# EasyEDA Pro project ProPrj_iamge v2_2026-08-18.epro, schematic Schematic1
Board Name: Board1; Create Date: 2026-07-20; Page Name: P1; Project Name: iamge v2; Schematic Name: Schematic1; Update Date: 2026-07-25; Company: EasyEDA.com; Page Size: A4; Version: V1.0
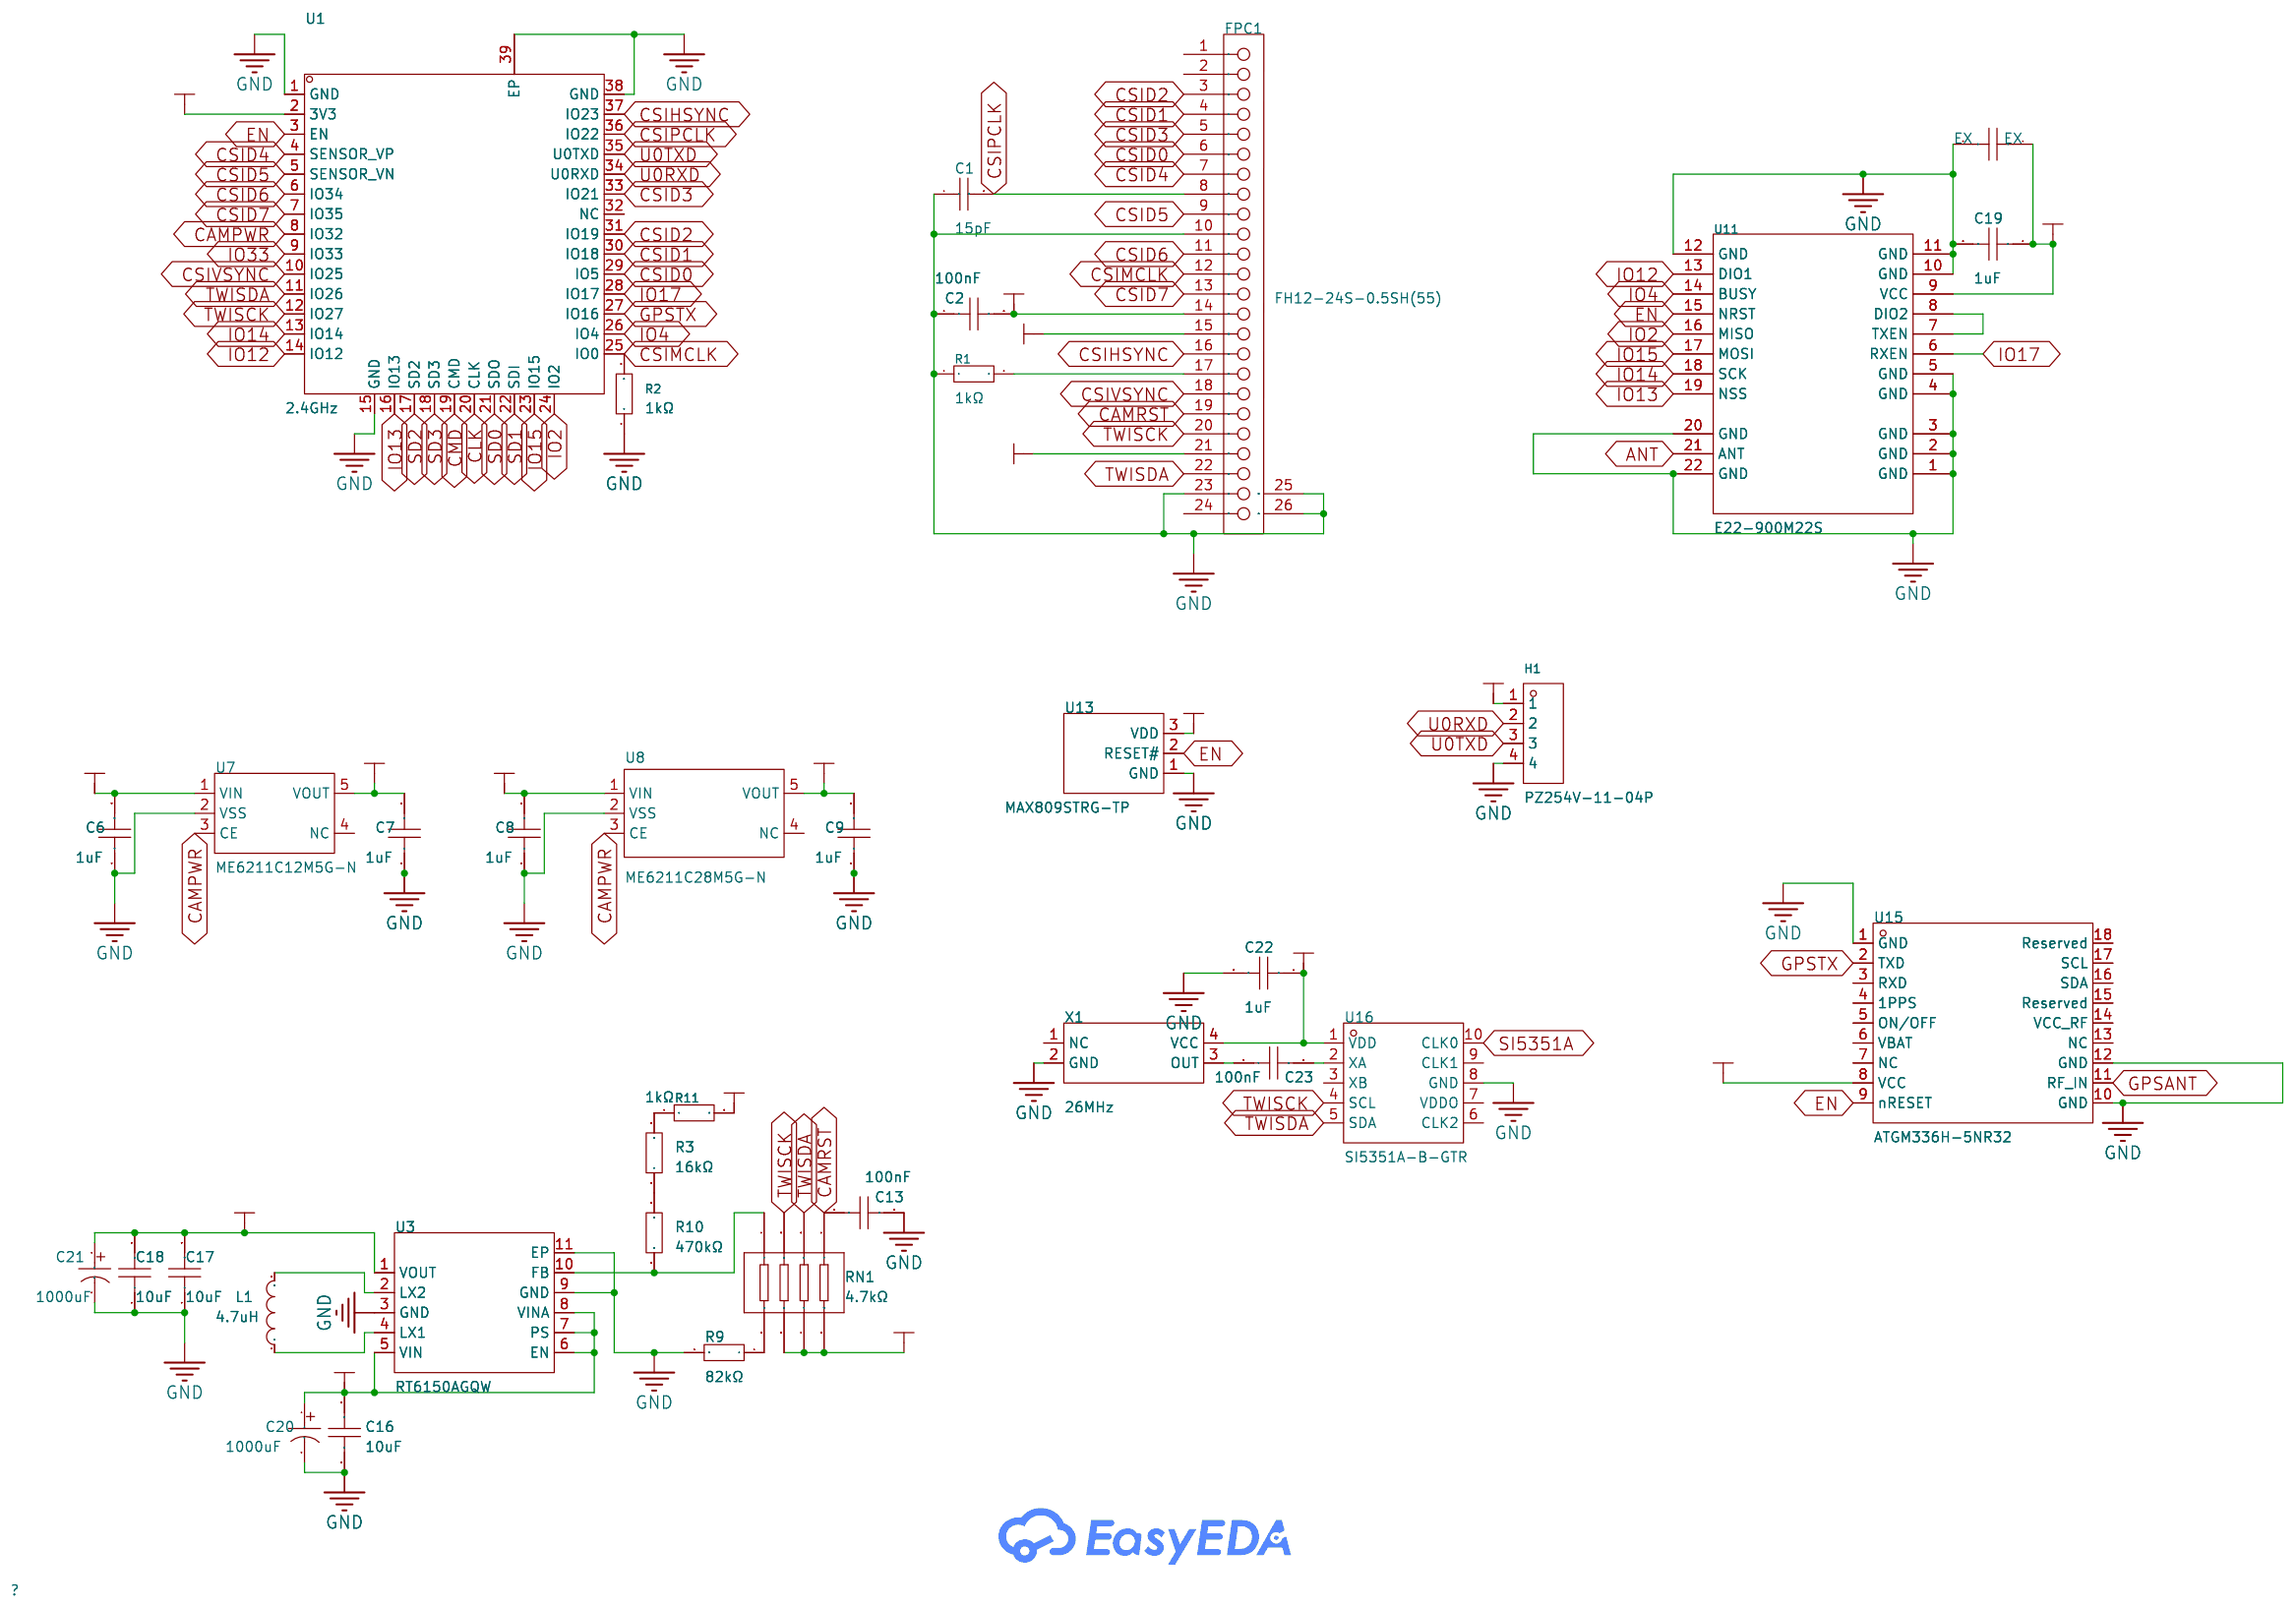
[diagram p0: schematic sheet]

## Parts
C1  15pF  [C0402]
C2  100nF  [C0402]
C6  1uF  [C0402]
C7  1uF  [C0402]
C8  1uF  [C0402]
C9  1uF  [C0402]
C13  100nF  [C0402]
C16  10uF  [C0603]
C17  10uF  [C0603]
C18  10uF  [C0603]
C19  1uF  [C0402]
C20  1000uF  [CAP-TH_BD6.3-P2.50-D1.0-FD]
C21  1000uF  [CAP-TH_BD6.3-P2.50-D1.0-FD]
C22  1uF  [C0402]
C23  100nF  [C0402]
EX  EX  [C1206]
FPC1  FH12-24S-0.5SH(55)  [FPC-SMD_FH12-24S-0.5SH-55]
H1  PZ254V-11-04P  [HDR-TH_4P-P2.54-V-M]
L1  4.7uH  [IND-SMD_L2.5-W2.0-VLS252012CX-150M]
R1  1kΩ  [R1206]
R2  1kΩ  [R1206]
R3  16kΩ  [R0805]
R9  82kΩ  [R0805]
R10  470kΩ  [R0805]
R11  1kΩ  [R1206]
RN1  4.7kΩ  [RES-ARRAY-SMD_0603-8P-L3.2-W1.6-BL]
U1  2.4GHz  [WIRELM-SMD_ESP32-S]
U3  RT6150AGQW  [WDFN-10_L3.0-W3.0-P0.50-BL-EP]
U7  ME6211C12M5G-N  [SOT-23-5_L3.0-W1.7-P0.95-LS2.8-BL]
U8  ME6211C28M5G-N  [SOT-23-5_L3.0-W1.7-P0.95-LS2.8-BR]
U11  E22-900M22S  [WIRELM-SMD_E22-900M22S]
U13  MAX809STRG-TP  [SOT-23-3_L2.9-W1.3-P1.90-LS2.4-BR]
U15  ATGM336H-5NR32  [GPS-SMD_18P-L10.1-W9.7-P1.10-TL]
U16  SI5351A-B-GTR  [MSOP-10_L3.0-W3.0-P0.50-LS5.0-BL]
X1  26MHz  [OSC-SMD_4P-L2.5-W2.0-BL_X1G0042110003]

## Library data of the parts
C1 = 0402CG150J500NT: Capacitance:15pF Tolerance:±5% Tolerance:±5% Voltage Rating:50V Temperature Coefficient:C0G; LCSC Part Name: 15pF ±5% 50V; Supplier Part: C1548; Manufacturer: FH(风华); Supplier Footprint: 0402; JLCPCB Part Class: Basic Part; Datasheet: https://item.szlcsc.com/datasheet/0402CG150J500NT/1900.html; Supplier: LCSC; Tolerance: ±5%; Voltage Rating: 50V; Temperature Coefficient: C0G
C2 C13 C23 = CL05B104KO5NNNC: Capacitance:100nF Tolerance:±10% Tolerance:±10% Voltage Rating:16V Temperature Coefficient:X7R; LCSC Part Name: 100nF ±10% 16V; Supplier Part: C1525; Manufacturer: SAMSUNG(三星); Supplier Footprint: 0402; JLCPCB Part Class: Basic Part; Datasheet: https://item.szlcsc.com/datasheet/CL05B104KO5NNNC/1877.html; Supplier: LCSC; Tolerance: ±10%; Voltage Rating: 16V; Temperature Coefficient: X7R
C6-C9 C19 C22 = CL05A105KA5NQNC: Capacitance:1uF Tolerance:±10% Tolerance:±10% Voltage Rating:25V Temperature Coefficient:X5R; LCSC Part Name: 1uF ±10% 25V; Supplier Part: C52923; Manufacturer: SAMSUNG(三星); Supplier Footprint: 0402; JLCPCB Part Class: Basic Part; Datasheet: https://item.szlcsc.com/datasheet/CL05A105KA5NQNC/53938.html; Supplier: LCSC; Tolerance: ±10%; Voltage Rating: 25V; Temperature Coefficient: X5R
C16-C18 = CL10A106KP8NNNC: Capacitance:10uF Tolerance:±10% Tolerance:±10% Voltage Rating:10V Temperature Coefficient:X5R; LCSC Part Name: 10uF ±10% 10V; Supplier Part: C19702; Manufacturer: SAMSUNG(三星); Supplier Footprint: 0603; JLCPCB Part Class: Basic Part; Datasheet: https://item.szlcsc.com/datasheet/CL10A106KP8NNNC/20411.html; Supplier: LCSC; Tolerance: ±10%; Voltage Rating: 10V; Temperature Coefficient: X5R
C20 C21 = SPZ0JM102E10O00RAXXX: Capacitance:1000uF Tolerance:±20% Tolerance:±20% Voltage Rating:6.3V Ripple Current:5.15A@100kHz Equivalent Series Resistance(ESR):10mΩ@100kHz Type:- Pin Spacing:2.5mm Diameter:6.3mm Height - Seated (Max):10mm Lifetime:2000hrs@105℃ Operating Temperature:-; LCSC Part Name: 1000uF ±20% 6.3V CLEAR 适用于系统板、显示卡、小充电器和智能电视; Supplier Part: C112521; Manufacturer: AISHI(艾华集团); Supplier Footprint: 插件,D6.3xL10mm; JLCPCB Part Class: Extended Part; Datasheet: https://item.szlcsc.com/datasheet/SPZ0JM102E10O00RAXXX/113754.html; Supplier: LCSC; Tolerance: ±20%; Voltage Rating: 6.3V; Ripple Current: 5.15A@100kHz; Equivalent Series Resistance(ESR): 10mΩ@100kHz; Pin Spacing: 2.5mm; Diameter: 6.3mm; Height - Seated (Max): 10mm; Lifetime: 2000hrs@105℃; Operating Temperature: -55℃~+105℃
EX = TCC1206X7R102K102DTS: Capacitance:1nF Tolerance:±10% Tolerance:±10% Voltage Rating:1kV Temperature Coefficient:X7R; LCSC Part Name: 1nF ±10% 1kV; Supplier Part: C282811; Manufacturer: CCTC(三环); Supplier Footprint: 1206; JLCPCB Part Class: Extended Part; Datasheet: https://item.szlcsc.com/datasheet/TCC1206X7R102K102DTS/268782.html; Supplier: LCSC; Tolerance: ±10%; Voltage Rating: 1kV; Temperature Coefficient: X7R
FPC1 = FH12-24S-0.5SH(55): Locking Feature:Hinged Lid Contact Type:Bottom Contact Number of Contacts:24P Pitch:0.5mm Mounting Type:Surface Mount, Right Angle FFC, FCB Thickness:0.3mm FFC, FCB Thickness:0.3mm Height Above Board:2mm Contact Material:Phosphor Bronze Contact Plating:Go; LCSC Part Name: 间距:0.5mm P数:24P 翻盖式 下接; Supplier Part: C202112; Manufacturer: HRS(广濑); Supplier Footprint: SMD,P=0.5mm,卧贴; JLCPCB Part Class: Extended Part; Datasheet: https://item.szlcsc.com/datasheet/FH12-24S-0.5SH(55)/203289.html; Supplier: LCSC; Locking Feature: Hinged Lid; Contact Type: Bottom Contact; Number of Contacts: 24P; Pitch: 0.5mm; Mounting Type: Surface Mount, Right Angle; FFC, FCB Thickness: 0.3mm; Height Above Board: 2mm; Contact Material: Phosphor Bronze; Contact Plating: Gold; Operating Temperature: -40℃~+85℃
H1 = PZ254V-11-04P: Pin Structure:1x4P Pitch:2.54mm Row Spacing:- Circluar Pins/Square Pins:Pin Header Mounting Type:Through Hole Number of Rows:1 Number of Pins:4P Current Rating:3A Voltage Rating (Max):250V Length of Mating Pin:6mm Insulation Height:2.5mm Length of End Con; LCSC Part Name: 1x4P 间距:2.54mm 方针 直插; Supplier Part: C2691448; Manufacturer: XFCN(兴飞); Supplier Footprint: 插件,P=2.54mm; JLCPCB Part Class: Extended Part; Datasheet: https://item.szlcsc.com/datasheet/PZ254V-11-04P/2801085.html; Supplier: LCSC; Pin Structure: 1x4P; Pitch: 2.54mm; Circluar Pins/Square Pins: Pin Header; Mounting Type: Through Hole; Number of Rows: 1; Number of Pins: 4P; Current Rating: 3A; Voltage Rating (Max): 250V; Length of Mating Pin: 6mm; Insulation Height: 2.5mm; Length of End Connection Pin: 3mm; Operating Temperature: -40℃~+105℃; Color: Black
L1 = FTC252010S4R7MBCA: Inductance:4.7uH Tolerance:±20% Tolerance:±20% Current Rating:2A Current - Saturation(Isat):2.6A DC Resistance(DCR):160mΩ Type:-; LCSC Part Name: 4.7uH ±20% 2.6A; Supplier Part: C5832360; Manufacturer: cjiang(长江微电); Supplier Footprint: 1008; JLCPCB Part Class: Extended Part; Datasheet: https://item.szlcsc.com/datasheet/FTC252010S4R7MBCA/6763480.html; Supplier: LCSC; Tolerance: ±20%; Current Rating: 2A; Current - Saturation(Isat): 2.6A; DC Resistance(DCR): 160mΩ
R1 R2 R11 = 1206W4F1001T5E_C4410: Type:Thick Film Resistor Resistance:1kΩ Tolerance:±1% Tolerance:±1% Power(Watts):250mW Voltage-Supply(Max):200V Temperature Coefficient:±100ppm/℃ Temperature Coefficient:±100ppm/℃ Operating Temperature:-55℃~+155℃ Operating Temperature:-55℃~+155℃; LCSC Part Name: 1kΩ ±1% 250mW 厚膜电阻; Supplier Part: C4410; Manufacturer: UNI-ROYAL(厚声); Manufacturer Part: 1206W4F1001T5E; Supplier Footprint: 1206; JLCPCB Part Class: Basic Part; Datasheet: https://item.szlcsc.com/datasheet/1206W4F1001T5E/4817.html; Supplier: LCSC; Type: Thick Film Resistor; Tolerance: ±1%; Power(Watts): 250mW; Voltage-Supply(Max): 200V; Temperature Coefficient: ±100ppm/℃; Operating Temperature: -55℃~+155℃
R3 = 0805W8F1602T5E: Type:Thick Film Resistor Resistance:16kΩ Tolerance:±1% Tolerance:±1% Power(Watts):125mW Voltage-Supply(Max):150V Temperature Coefficient:±100ppm/℃ Temperature Coefficient:±100ppm/℃ Operating Temperature:-55℃~+155℃ Operating Temperature:-55℃~+155℃; LCSC Part Name: 16kΩ ±1% 125mW 厚膜电阻; Supplier Part: C17490; Manufacturer: UNI-ROYAL(厚声); Supplier Footprint: 0805; JLCPCB Part Class: Extended Part; Datasheet: https://item.szlcsc.com/datasheet/0805W8F1602T5E/18178.html; Supplier: LCSC; Type: Thick Film Resistor; Tolerance: ±1%; Power(Watts): 125mW; Voltage-Supply(Max): 150V; Temperature Coefficient: ±100ppm/℃; Operating Temperature: -55℃~+155℃
R9 = 0805W8F8202T5E: Type:Thick Film Resistor Resistance:82kΩ Tolerance:±1% Tolerance:±1% Power(Watts):125mW Voltage-Supply(Max):150V Temperature Coefficient:±100ppm/℃ Temperature Coefficient:±100ppm/℃ Operating Temperature:-55℃~+155℃ Operating Temperature:-55℃~+155℃; LCSC Part Name: 82kΩ ±1% 125mW 厚膜电阻; Supplier Part: C17840; Manufacturer: UNI-ROYAL(厚声); Supplier Footprint: 0805; JLCPCB Part Class: Extended Part; Datasheet: https://item.szlcsc.com/datasheet/0805W8F8202T5E/18528.html; Supplier: LCSC; Type: Thick Film Resistor; Tolerance: ±1%; Power(Watts): 125mW; Voltage-Supply(Max): 150V; Temperature Coefficient: ±100ppm/℃; Operating Temperature: -55℃~+155℃
R10 = 0805W8F4703T5E: Type:Thick Film Resistor Resistance:470kΩ Tolerance:±1% Tolerance:±1% Power(Watts):125mW Voltage-Supply(Max):150V Temperature Coefficient:±100ppm/℃ Temperature Coefficient:±100ppm/℃ Operating Temperature:-55℃~+155℃ Operating Temperature:-55℃~+155℃; LCSC Part Name: 470kΩ ±1% 125mW 厚膜电阻; Supplier Part: C17709; Manufacturer: UNI-ROYAL(厚声); Supplier Footprint: 0805; JLCPCB Part Class: Basic Part; Datasheet: https://item.szlcsc.com/datasheet/0805W8F4703T5E/18397.html; Supplier: LCSC; Type: Thick Film Resistor; Tolerance: ±1%; Power(Watts): 125mW; Voltage-Supply(Max): 150V; Temperature Coefficient: ±100ppm/℃; Operating Temperature: -55℃~+155℃
RN1 = 4D03WGJ0472T5E: Number of Resistors: Resistance:4.7kΩ Tolerance:±5% Tolerance:±5% Power(Watts):62.5mW Temperature Coefficient:±200ppm/℃ Temperature Coefficient:±200ppm/℃ Number of Pins:; LCSC Part Name: 4.7kΩ ±5%; Supplier Part: C1980; Manufacturer: UNI-ROYAL(厚声); Supplier Footprint: 0603x4; JLCPCB Part Class: Basic Part; Datasheet: https://item.szlcsc.com/datasheet/4D03WGJ0472T5E/2332.html; Supplier: LCSC; Tolerance: ±5%; Power(Watts): 62.5mW; Temperature Coefficient: ±200ppm/℃
U1 = ESP32-S: Utilized IC / Part:ESP32 Chip Wireless Standard:- Interface Type:I2C；UART；SPI Frequency:2.4GHz Antenna Type:IPEX interface Output Power:17dBm Output Power:17dBm Voltage - Supply:3.3V Voltage - Supply:3.3V Receive  Current:- Send  Current:- Sensitivity:-90; LCSC Part Name: Wi-Fi+BT SoC模组; Supplier Part: C277944; Manufacturer: Ai-Thinker(安信可); Supplier Footprint: SMD; JLCPCB Part Class: Extended Part; Datasheet: https://item.szlcsc.com/datasheet/ESP32-S/265264.html; Supplier: LCSC; Utilized IC / Part: ESP32 Chip; Interface Type: I2C；UART；SPI; Antenna Type: IPEX interface; Output Power: 17dBm; Voltage - Supply: 3.3V; Sensitivity: -90dBm; Operating Temperature: -40℃~+85℃; Features: Integrated Bluetooth function；Over-the-air (OTA) update
U3 = RT6150AGQW: Function:Buck-Boost Voltage - Supply:1.8V~5.5V Voltage - Supply:1.8V~5.5V Output Voltage:1.8V~5.5V Output Voltage:1.8V~5.5V Output Current:800mA Frequency - Switching:1MHz Frequency - Switching:1MHz Operating Temperature:-40℃~+125℃@(TJ) Operating Temperat; LCSC Part Name: 升降压型 800mA 1.8V~5.5V; Supplier Part: C147971; Manufacturer: RICHTEK(立锜); Supplier Footprint: WDFN-10-EP(3x3); JLCPCB Part Class: Extended Part; Datasheet: https://item.szlcsc.com/datasheet/RT6150AGQW/159303.html; Supplier: LCSC; Function: Buck-Boost; Voltage - Supply: 1.8V~5.5V; Output Voltage: 1.8V~5.5V; Output Current: 800mA; Frequency - Switching: 1MHz; Operating Temperature: -40℃~+125℃@(TJ); Synchronous Rectifier: Yes; Number of Outputs: 1; Topology: Buck-Boost; Quiescent Current: 60uA; Switch tube (built-in/external): Built-in; Output Type: Adjustable; Features: Light load efficient mode；Overcurrent Protection；Load disconnect
U7 = ME6211C12M5G-N: Output Configuration:Positive Voltage - Supply:6V Output Voltage:1.2V Output Voltage:1.2V Output Current:300mA Power Supply Rejection Ratio (PSRR):70dB@(1kHz) Voltage Dropout:280mV@(100mA)；500mV@(200mA) standby current:30uA Noise:50uVrms Features:Enable c; LCSC Part Name: 1.2V 300mA 6V; Supplier Part: C236672; Manufacturer: MICRONE(南京微盟); Supplier Footprint: SOT-23-5; JLCPCB Part Class: Extended Part; Datasheet: https://item.szlcsc.com/datasheet/ME6211C12M5G-N/236112.html; Supplier: LCSC; Output Configuration: Positive; Voltage - Supply: 6V; Output Voltage: 1.2V; Output Current: 300mA; Power Supply Rejection Ratio (PSRR): 70dB@(1kHz); Voltage Dropout: 280mV@(100mA)；500mV@(200mA); standby current: 30uA; Noise: 50uVrms; Features: Enable control；Short Circuit Protection；Over Current Protection; Operating Temperature: -40℃~+150℃; Output Type: Fixed; Number of Outputs: 1
U8 = ME6211C28M5G-N: Output Configuration:Positive Voltage - Supply:6V Output Voltage:2.8V Output Voltage:2.8V Output Current:450mA Power Supply Rejection Ratio (PSRR):70dB@(1kHz) Voltage Dropout:220mV@(200mA) standby current:55uA Noise:50uVrms Features:Enable control Operati; LCSC Part Name: 2.8V 450mA 6V; Supplier Part: C53099; Manufacturer: MICRONE(南京微盟); Supplier Footprint: SOT-23-5; JLCPCB Part Class: Extended Part; Datasheet: https://item.szlcsc.com/datasheet/ME6211C28M5G-N/54115.html; Supplier: LCSC; Output Configuration: Positive; Voltage - Supply: 6V; Output Voltage: 2.8V; Output Current: 450mA; Power Supply Rejection Ratio (PSRR): 70dB@(1kHz); Voltage Dropout: 220mV@(200mA); standby current: 55uA; Noise: 50uVrms; Features: Enable control; Operating Temperature: -40℃~+85℃@(Ta); Output Type: Fixed; Number of Outputs: 1
U11 = E22-900M22S: Output Power:22.3dBm Output Power:22.3dBm Interface Type:SPI Modulation System:LoRa；FSK Voltage - Supply:2.5V~3.7V Voltage - Supply:2.5V~3.7V Antenna Type:Stamp Hole Antenna；IPEX interface Receive  Current:6.8mA Send  Current:119mA Sensitivity:-147dBm Sen; LCSC Part Name: 868/915MHz贴片型LoRa模块; Supplier Part: C411293; Manufacturer: EBYTE(亿佰特); Supplier Footprint: SMD,20x14mm; JLCPCB Part Class: Extended Part; Datasheet: https://item.szlcsc.com/datasheet/E22-900M22S/402604.html; Supplier: LCSC; Output Power: 22.3dBm; Interface Type: SPI; Modulation System: LoRa；FSK; Voltage - Supply: 2.5V~3.7V; Antenna Type: Stamp Hole Antenna；IPEX interface; Receive  Current: 6.8mA; Send  Current: 119mA; Sensitivity: -147dBm; Communication Distance: 7km
U13 = MAX809STRG-TP: ChipType:- Output Type:Push-pull Voltage - Supply:1V~5.5V Voltage - Supply:1V~5.5V Reset Active Level:Active Low Threshold Voltage:2.93V Number of Voltages Monitored:1 Reset Timeout:240ms Operating Temperature:-40℃~+85℃ Operating Temperature:-40℃~+85℃ Fun; Supplier Part: C52817138; Manufacturer: TECH PUBLIC(台舟); Supplier Footprint: SOT-23; JLCPCB Part Class: Extended Part; Datasheet: https://item.szlcsc.com/datasheet/MAX809STRG-TP/55726152.html; Supplier: LCSC; Output Type: Push-pull; Voltage - Supply: 1V~5.5V; Reset Active Level: Active Low; Threshold Voltage: 2.93V; Number of Voltages Monitored: 1; Reset Timeout: 240ms; Operating Temperature: -40℃~+85℃; Quiescent Current: 3uA
U15 = ATGM336H-5NR32: GNSS Type:QZSS；GLONASS；BDS；GALILEO；GPS Interface:UART Voltage - Supply:1.8V~3.6V Voltage - Supply:1.8V~3.6V Current - Supply:26mA@3.3V Sensitivity:-148dBm Sensitivity:-148dBm Accuracy:2.5m Time To First Fix:35s Operating Temperature:-40℃~+85℃ Operating Te; LCSC Part Name: BDS/GNSS全星座定位导航模块; Supplier Part: C5117921; Manufacturer: 杭州中科微; Supplier Footprint: LCC-18(10.1x9.7); JLCPCB Part Class: Extended Part; Datasheet: https://item.szlcsc.com/datasheet/ATGM336H-5NR32/5695797.html; Supplier: LCSC; GNSS Type: QZSS；GLONASS；BDS；GALILEO；GPS; Interface: UART; Voltage - Supply: 1.8V~3.6V; Current - Supply: 26mA@3.3V; Sensitivity: -148dBm; Accuracy: 2.5m; Time To First Fix: 35s; Operating Temperature: -40℃~+85℃
U16 = SI5351A-B-GTR: Interface:I2C Output Frequency(Max):200MHz Voltage - Supply:1.71V~3.6V Voltage - Supply:1.71V~3.6V Number of Outputs:3 Operating Temperature:-40℃~+85℃ Operating Temperature:-40℃~+85℃ Features:On-chip VCO/DCO；Built-in phase-locked loop；Spread spectrum；Prot; LCSC Part Name: 可生成2.5kHz至200MHz频率的时钟发生器; Supplier Part: C504891; Manufacturer: SKYWORKS/SILICON LABS(芯科); Supplier Footprint: MSOP-10; JLCPCB Part Class: Extended Part; Datasheet: https://item.szlcsc.com/datasheet/SI5351A-B-GTR/519851.html; Supplier: LCSC; Interface: I2C; Output Frequency(Max): 200MHz; Voltage - Supply: 1.71V~3.6V; Number of Outputs: 3; Operating Temperature: -40℃~+85℃; Features: On-chip VCO/DCO；Built-in phase-locked loop；Spread spectrum；Protocol-specific clock generation
X1 = X1G0042110003_C3013793: Frequency:26MHz Output Type:Clipped sine wave Voltage - Supply:2.85V~3.15V Voltage - Supply:2.85V~3.15V Current - Supply:1.5mA Operating Temperature:-30℃~+85℃ Operating Temperature:-30℃~+85℃; LCSC Part Name: 26MHz 2.85V~3.15V; Supplier Part: C3013793; Manufacturer: EPSON(爱普生); Manufacturer Part: X1G0042110003; Supplier Footprint: SMD2520-6P; JLCPCB Part Class: Extended Part; Datasheet: https://item.szlcsc.com/datasheet/X1G0042110003/3521901.html; Supplier: LCSC; Output Type: Clipped sine wave; Voltage - Supply: 2.85V~3.15V; Current - Supply: 1.5mA; Operating Temperature: -30℃~+85℃

## Nets
1.2V: C7.2 FPC1.15 U7.5(VOUT)
2.8V: C9.2 FPC1.21 U8.5(VOUT)
3.3V: C2.2 C6.2 C8.2 C17.2 C18.2 C19.1 C21.1 C22.1 EX.1 FPC1.14 H1.1 R11.2 RN1.6 RN1.7 RN1.8 U1.2(3V3) U3.1(VOUT) U7.1(VIN) U8.1(VIN) U11.9(VCC) U13.3(VDD) U15.8(VCC) U16.1(VDD) X1.4(VCC)
GND: C1.1 C2.1 C6.1 C7.1 C8.1 C9.1 C13.2 C16.1 C17.1 C18.1 C19.2 C20.2 C21.2 C22.2 EX.2 FPC1.10 FPC1.23 FPC1.25 FPC1.26 H1.4 R1.1 R2.1 R9.2 U1.1(GND) U1.15(GND) U1.38(GND) U1.39(EP) U3.3(GND) U3.9(GND) U3.11(EP) U7.2(VSS) U8.2(VSS) U11.1(GND) U11.2(GND) U11.3(GND) U11.4(GND) U11.5(GND) U11.10(GND) U11.11(GND) U11.12(GND) U11.20(GND) U11.22(GND) U13.1(GND) U15.1(GND) U15.10(GND) U15.12(GND) U16.8(GND) X1.2(GND)
ANT: U11.21(ANT)
CAMPWR: U1.8(IO32) U7.3(CE) U8.3(CE)
CAMRST: C13.1 FPC1.19 RN1.1
CLK: U1.20(CLK)
CMD: U1.19(CMD)
CSID0: FPC1.6 U1.29(IO5)
CSID1: FPC1.4 U1.30(IO18)
CSID2: FPC1.3 U1.31(IO19)
CSID3: FPC1.5 U1.33(IO21)
CSID4: FPC1.7 U1.4(SENSOR_VP)
CSID5: FPC1.9 U1.5(SENSOR_VN)
CSID6: FPC1.11 U1.6(IO34)
CSID7: FPC1.13 U1.7(IO35)
CSIHSYNC: FPC1.16 U1.37(IO23)
CSIMCLK: FPC1.12 R2.2 U1.25(IO0)
CSIPCLK: C1.2 FPC1.8 U1.36(IO22)
CSIVSYNC: FPC1.18 U1.10(IO25)
EN: U1.3(EN) U11.15(NRST) U13.2(RESET#) U15.9(nRESET)
GPSANT: U15.11(RF_IN)
GPSTX: U1.27(IO16) U15.2(TXD)
IO2: U1.24(IO2) U11.16(MISO)
IO4: U1.26(IO4) U11.14(BUSY)
IO12: U1.14(IO12) U11.13(DIO1)
IO13: U1.16(IO13) U11.19(NSS)
IO14: U1.13(IO14) U11.18(SCK)
IO15: U1.23(IO15) U11.17(MOSI)
IO17: U1.28(IO17) U11.6(RXEN)
IO33: U1.9(IO33)
PV: C16.2 C20.1 U3.5(VIN) U3.6(EN) U3.7(PS) U3.8(VINA)
SD0: U1.21(SDO)
SD1: U1.22(SDI)
SD2: U1.17(SD2)
SD3: U1.18(SD3)
SI5351A: U16.10(CLK0)
TWISCK: FPC1.20 RN1.3 U1.12(IO27) U16.4(SCL)
TWISDA: FPC1.22 RN1.2 U1.11(IO26) U16.5(SDA)
U0RXD: H1.2 U1.34(U0RXD)
U0TXD: H1.3 U1.35(U0TXD)
$1N1695: FPC1.17 R1.2
$1N2495: R10.1 RN1.4 U3.10(FB)
$1N3016: L1.1 U3.4(LX1)
$1N3080: L1.2 U3.2(LX2)
$1N10358: U11.7(TXEN) U11.8(DIO2)
$1N13935: R9.1 RN1.5
$1N14131: R3.1 R10.2
$1N14210: R3.2 R11.1
$1N18901: C23.2 U16.2(XA)
$1N18905: C23.1 X1.3(OUT)

Not connected (* = marked no-connect by the designer): FPC1 1 2 24; U1 32(NC); U7 4(NC); U8 4(NC); U15 3(RXD) 4(1PPS) 5(ON/OFF) 6(VBAT) 7(NC) 13(NC) 14(VCC_RF) 15(Reserved) 16(SDA) 17(SCL) 18(Reserved); U16 3(XB) 6(CLK2) 7(VDDO) 9(CLK1); X1 1(NC)
